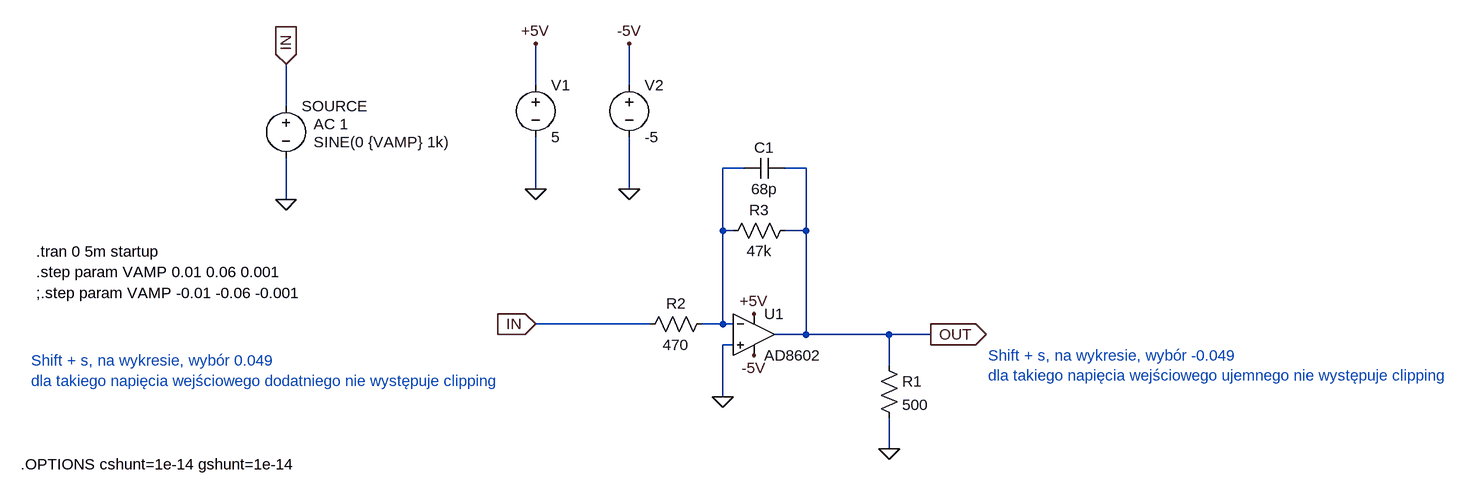
[diagram p0: schematic clipping500.asc]
clipping500.asc, the LTspice schematic file:
Version 4.1
SHEET 1 1572 680
WIRE 96 -128 96 -192
WIRE 240 -128 240 -192
WIRE -288 -96 -288 -160
WIRE 416 0 384 0
WIRE 512 0 480 0
WIRE 96 32 96 -48
WIRE 240 32 240 -48
WIRE -288 48 -288 -16
WIRE 384 96 384 0
WIRE 400 96 384 96
WIRE 512 96 512 0
WIRE 512 96 480 96
WIRE 272 240 96 240
WIRE 384 240 384 96
WIRE 384 240 352 240
WIRE 400 240 384 240
WIRE 512 256 512 96
WIRE 512 256 464 256
WIRE 640 256 512 256
WIRE 704 256 640 256
WIRE 400 272 384 272
WIRE 640 304 640 256
WIRE 384 352 384 272
WIRE 640 432 640 384
FLAG 96 -192 +5V
FLAG 240 -192 -5V
FLAG 96 32 0
FLAG 240 32 0
FLAG 96 240 IN
IOPIN 96 240 In
FLAG 384 352 0
FLAG 432 288 -5V
FLAG 432 224 +5V
FLAG 704 256 OUT
IOPIN 704 256 Out
FLAG -288 -160 IN
IOPIN -288 -160 In
FLAG -288 48 0
FLAG 640 432 0
SYMBOL OpAmps\\AD8602 432 192 R0
SYMATTR InstName U1
SYMBOL voltage 96 -144 R0
WINDOW 123 0 0 Left 0
WINDOW 39 0 0 Left 0
SYMATTR InstName V1
SYMATTR Value 5
SYMBOL voltage 240 -144 R0
WINDOW 123 0 0 Left 0
WINDOW 39 0 0 Left 0
SYMATTR InstName V2
SYMATTR Value -5
SYMBOL res 368 224 R90
WINDOW 0 0 56 VBottom 2
WINDOW 3 32 56 VTop 2
SYMATTR InstName R2
SYMATTR Value 470
SYMBOL res 496 80 R90
WINDOW 0 0 56 VBottom 2
WINDOW 3 32 56 VTop 2
SYMATTR InstName R3
SYMATTR Value 47k
SYMBOL voltage -288 -112 R0
WINDOW 123 43 44 Left 2
WINDOW 39 0 0 Left 0
WINDOW 3 43 72 Left 2
SYMATTR Value2 AC 1
SYMATTR Value SINE(0 {VAMP} 1k)
SYMATTR InstName SOURCE
SYMBOL cap 480 -16 R90
WINDOW 0 0 32 VBottom 2
WINDOW 3 32 32 VTop 2
SYMATTR InstName C1
SYMATTR Value 68p
SYMATTR SpiceLine V=50
SYMBOL res 624 288 R0
SYMATTR InstName R1
SYMATTR Value 500
TEXT -696 456 Left 2 !.OPTIONS cshunt=1e-14 gshunt=1e-14
TEXT -672 192 Left 2 !;.step param VAMP -0.01 -0.06 -0.001
TEXT -672 128 Left 2 !.tran 0 5m startup
TEXT -680 296 Left 2 ;Shift + s, na wykresie, wybór 0.049\ndla takiego napięcia wejściowego dodatniego nie występuje clipping
TEXT -672 160 Left 2 !.step param VAMP 0.01 0.06 0.001
TEXT 792 288 Left 2 ;Shift + s, na wykresie, wybór -0.049\ndla takiego napięcia wejściowego ujemnego nie występuje clipping

The netlist it stands for:
* clipping500.asc
X§U1 0 N001 +5V -5V OUT AD8602  ; pins In+ In- V+ V- OUT
V1 +5V 0 5
V2 -5V 0 -5
R2 N001 IN 470
R3 OUT N001 47k
V§SOURCE IN 0 SINE(0 {VAMP} 1k) AC 1
C1 OUT N001 68p V=50
R1 OUT 0 500
.OPTIONS cshunt=1e-14 gshunt=1e-14
;.step param VAMP -0.01 -0.06 -0.001
.tran 0 5m startup
* Shift + s, na wykresie, wybór 0.049
* dla takiego napięcia wejściowego dodatniego nie występuje clipping
.step param VAMP 0.01 0.06 0.001
* Shift + s, na wykresie, wybór -0.049
* dla takiego napięcia wejściowego ujemnego nie występuje clipping
.backanno
.end